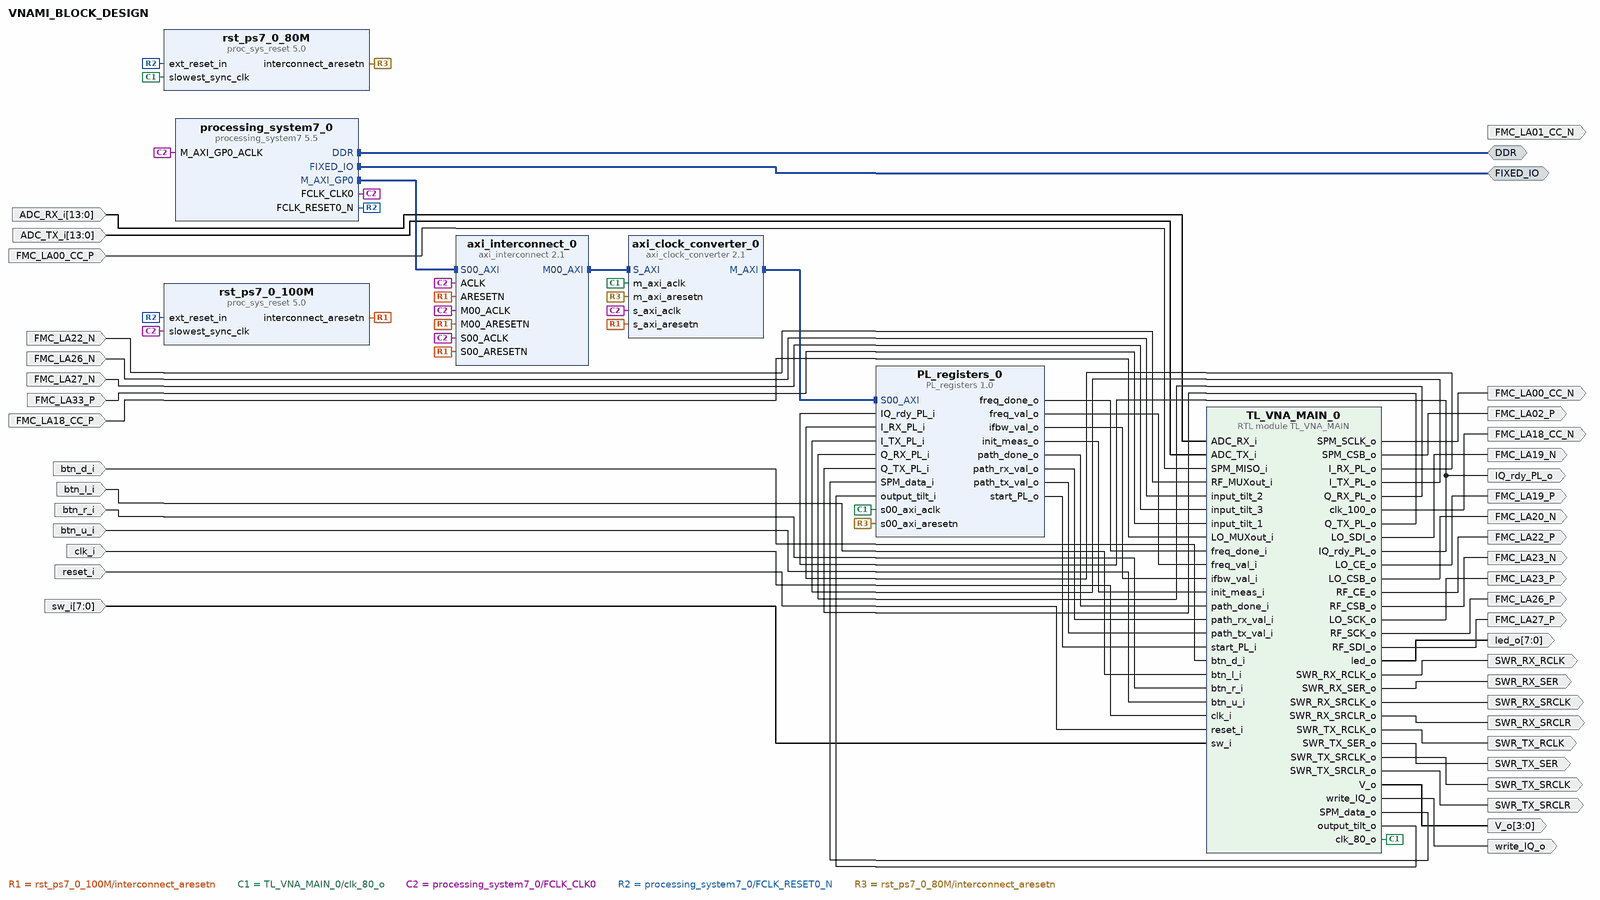
[diagram p0: block diagram of the top level]
# Vivado block design VNAMI_BLOCK_DESIGN, xc7z020clg484-1, Vivado 2023.2
create_bd_design VNAMI_BLOCK_DESIGN

create_bd_intf_port -mode Master -vlnv xilinx.com:interface:ddrx_rtl:1.0 DDR
create_bd_intf_port -mode Master -vlnv xilinx.com:display_processing_system7:fixedio_rtl:1.0 FIXED_IO
create_bd_port -dir O FMC_LA26_P
create_bd_port -dir I FMC_LA22_N
create_bd_port -dir O FMC_LA23_N
create_bd_port -dir O FMC_LA27_P
create_bd_port -dir I btn_d_i
create_bd_port -dir I btn_l_i
create_bd_port -dir I btn_r_i
create_bd_port -dir I btn_u_i
create_bd_port -dir I clk_i
create_bd_port -dir O -from 7 -to 0 led_o
create_bd_port -dir I -type rst reset_i
create_bd_port -dir I -from 7 -to 0 sw_i
create_bd_port -dir O FMC_LA23_P
create_bd_port -dir O FMC_LA20_N
create_bd_port -dir I FMC_LA18_CC_P
create_bd_port -dir O FMC_LA01_CC_N
create_bd_port -dir O FMC_LA18_CC_N
create_bd_port -dir I -from 13 -to 0 ADC_TX_i
create_bd_port -dir I -from 13 -to 0 ADC_RX_i
create_bd_port -dir I FMC_LA33_P
create_bd_port -dir I FMC_LA26_N
create_bd_port -dir I FMC_LA27_N
create_bd_port -dir O FMC_LA00_CC_N
create_bd_port -dir I FMC_LA00_CC_P
create_bd_port -dir O FMC_LA02_P
create_bd_port -dir O FMC_LA19_N
create_bd_port -dir O IQ_rdy_PL_o
create_bd_port -dir O write_IQ_o
create_bd_port -dir O SWR_TX_SER
create_bd_port -dir O SWR_TX_SRCLK
create_bd_port -dir O SWR_TX_RCLK
create_bd_port -dir O SWR_TX_SRCLR
create_bd_port -dir O SWR_RX_SER
create_bd_port -dir O SWR_RX_SRCLK
create_bd_port -dir O SWR_RX_SRCLR
create_bd_port -dir O SWR_RX_RCLK
create_bd_port -dir O FMC_LA22_P
create_bd_port -dir O FMC_LA19_P
create_bd_port -dir O -from 3 -to 0 V_o

create_bd_cell -type module -reference TL_VNA_MAIN TL_VNA_MAIN_0
create_bd_cell -type ip -vlnv Julien:user:PL_registers:1.0 PL_registers_0
create_bd_cell -type ip -vlnv xilinx.com:ip:proc_sys_reset:5.0 rst_ps7_0_100M
create_bd_cell -type ip -vlnv xilinx.com:ip:processing_system7:5.5 processing_system7_0
set_property -dict [list \
  CONFIG.PCW_APU_PERIPHERAL_FREQMHZ 666.666666 \
  CONFIG.PCW_ENET0_PERIPHERAL_ENABLE 0 \
  CONFIG.PCW_FPGA0_PERIPHERAL_FREQMHZ 100 \
  CONFIG.PCW_FPGA1_PERIPHERAL_FREQMHZ 80 \
  CONFIG.PCW_GPIO_MIO_GPIO_ENABLE 0 \
  CONFIG.PCW_PRESET_BANK1_VOLTAGE {LVCMOS 3.3V} \
  CONFIG.PCW_QSPI_PERIPHERAL_ENABLE 0 \
  CONFIG.PCW_SD0_PERIPHERAL_ENABLE 0 \
  CONFIG.PCW_UART1_PERIPHERAL_ENABLE 0 \
  CONFIG.PCW_UIPARAM_DDR_FREQ_MHZ 533.333333 \
  CONFIG.PCW_UIPARAM_DDR_PARTNO {MT41J128M8 JP-125} \
  CONFIG.PCW_USB0_PERIPHERAL_ENABLE 0 \
] [get_bd_cells processing_system7_0]
# 59 more settings of processing_system7_0 are not shown: defaults, MIO pin electricals, DDR timing, and values the tool derives
create_bd_cell -type ip -vlnv xilinx.com:ip:proc_sys_reset:5.0 rst_ps7_0_80M
create_bd_cell -type ip -vlnv xilinx.com:ip:axi_clock_converter:2.1 axi_clock_converter_0
create_bd_cell -type ip -vlnv xilinx.com:ip:axi_interconnect:2.1 axi_interconnect_0
set_property -dict {CONFIG.NUM_MI 1 CONFIG.S00_HAS_DATA_FIFO 0 CONFIG.S00_HAS_REGSLICE 3} [get_bd_cells axi_interconnect_0]

# ---- connections ----

connect_bd_intf_net [get_bd_intf_pins axi_interconnect_0/S00_AXI] [get_bd_intf_pins processing_system7_0/M_AXI_GP0]
connect_bd_intf_net [get_bd_intf_pins axi_clock_converter_0/M_AXI] [get_bd_intf_pins PL_registers_0/S00_AXI]
connect_bd_intf_net -intf_net axi_interconnect_1_M00_AXI [get_bd_intf_pins axi_interconnect_0/M00_AXI] [get_bd_intf_pins axi_clock_converter_0/S_AXI]
connect_bd_intf_net -intf_net processing_system7_1_DDR [get_bd_intf_ports DDR] [get_bd_intf_pins processing_system7_0/DDR]
connect_bd_intf_net -intf_net processing_system7_1_FIXED_IO [get_bd_intf_ports FIXED_IO] [get_bd_intf_pins processing_system7_0/FIXED_IO]
connect_bd_net -net ADC_RX_i_0_1 [get_bd_ports ADC_RX_i] [get_bd_pins TL_VNA_MAIN_0/ADC_RX_i]
connect_bd_net -net ADC_TX_i_0_1 [get_bd_ports ADC_TX_i] [get_bd_pins TL_VNA_MAIN_0/ADC_TX_i]
connect_bd_net [get_bd_ports FMC_LA00_CC_P] [get_bd_pins TL_VNA_MAIN_0/SPM_MISO_i]
connect_bd_net -net FMC_LA04_P_0_1 [get_bd_ports FMC_LA22_N] [get_bd_pins TL_VNA_MAIN_0/RF_MUXout_i]
connect_bd_net [get_bd_ports FMC_LA26_N] [get_bd_pins TL_VNA_MAIN_0/input_tilt_2]
connect_bd_net [get_bd_ports FMC_LA27_N] [get_bd_pins TL_VNA_MAIN_0/input_tilt_3]
connect_bd_net [get_bd_ports FMC_LA33_P] [get_bd_pins TL_VNA_MAIN_0/input_tilt_1]
connect_bd_net -net LO_MUXout_i_0_1 [get_bd_ports FMC_LA18_CC_P] [get_bd_pins TL_VNA_MAIN_0/LO_MUXout_i]
connect_bd_net [get_bd_pins PL_registers_0/freq_done_o] [get_bd_pins TL_VNA_MAIN_0/freq_done_i]
connect_bd_net [get_bd_pins PL_registers_0/freq_val_o] [get_bd_pins TL_VNA_MAIN_0/freq_val_i]
connect_bd_net [get_bd_pins PL_registers_0/ifbw_val_o] [get_bd_pins TL_VNA_MAIN_0/ifbw_val_i]
connect_bd_net [get_bd_pins PL_registers_0/init_meas_o] [get_bd_pins TL_VNA_MAIN_0/init_meas_i]
connect_bd_net [get_bd_pins PL_registers_0/path_done_o] [get_bd_pins TL_VNA_MAIN_0/path_done_i]
connect_bd_net [get_bd_pins PL_registers_0/path_rx_val_o] [get_bd_pins TL_VNA_MAIN_0/path_rx_val_i]
connect_bd_net [get_bd_pins PL_registers_0/path_tx_val_o] [get_bd_pins TL_VNA_MAIN_0/path_tx_val_i]
connect_bd_net [get_bd_pins PL_registers_0/start_PL_o] [get_bd_pins TL_VNA_MAIN_0/start_PL_i]
connect_bd_net -net S00_ARESETN_1 [get_bd_pins rst_ps7_0_100M/interconnect_aresetn] \
  [get_bd_pins axi_interconnect_0/S00_ARESETN] [get_bd_pins axi_interconnect_0/ARESETN] \
  [get_bd_pins axi_interconnect_0/M00_ARESETN] [get_bd_pins axi_clock_converter_0/s_axi_aresetn]
connect_bd_net -net TL_VNA_MAIN_0_CSB_o [get_bd_pins TL_VNA_MAIN_0/SPM_CSB_o] [get_bd_ports FMC_LA02_P]
connect_bd_net -net TL_VNA_MAIN_0_FMC_LA04_N [get_bd_pins TL_VNA_MAIN_0/RF_SCK_o] [get_bd_ports FMC_LA26_P]
connect_bd_net -net TL_VNA_MAIN_0_FMC_LA07_N [get_bd_pins TL_VNA_MAIN_0/RF_CSB_o] [get_bd_ports FMC_LA23_N]
connect_bd_net -net TL_VNA_MAIN_0_FMC_LA07_P [get_bd_pins TL_VNA_MAIN_0/RF_SDI_o] [get_bd_ports FMC_LA27_P]
connect_bd_net [get_bd_pins TL_VNA_MAIN_0/IQ_rdy_PL_o] [get_bd_ports IQ_rdy_PL_o] [get_bd_pins PL_registers_0/IQ_rdy_PL_i]
connect_bd_net [get_bd_pins TL_VNA_MAIN_0/I_RX_PL_o] [get_bd_pins PL_registers_0/I_RX_PL_i]
connect_bd_net [get_bd_pins TL_VNA_MAIN_0/I_TX_PL_o] [get_bd_pins PL_registers_0/I_TX_PL_i]
connect_bd_net [get_bd_pins TL_VNA_MAIN_0/LO_CE_o] [get_bd_ports FMC_LA19_P]
connect_bd_net [get_bd_pins TL_VNA_MAIN_0/LO_CSB_o] [get_bd_ports FMC_LA20_N]
connect_bd_net [get_bd_pins TL_VNA_MAIN_0/LO_SCK_o] [get_bd_ports FMC_LA23_P]
connect_bd_net [get_bd_pins TL_VNA_MAIN_0/LO_SDI_o] [get_bd_ports FMC_LA19_N]
connect_bd_net [get_bd_pins TL_VNA_MAIN_0/Q_RX_PL_o] [get_bd_pins PL_registers_0/Q_RX_PL_i]
connect_bd_net [get_bd_pins TL_VNA_MAIN_0/Q_TX_PL_o] [get_bd_pins PL_registers_0/Q_TX_PL_i]
connect_bd_net [get_bd_pins TL_VNA_MAIN_0/RF_CE_o] [get_bd_ports FMC_LA22_P]
connect_bd_net -net TL_VNA_MAIN_0_SCLK_o [get_bd_pins TL_VNA_MAIN_0/SPM_SCLK_o] [get_bd_ports FMC_LA00_CC_N]
connect_bd_net [get_bd_pins TL_VNA_MAIN_0/SPM_data_o] [get_bd_pins PL_registers_0/SPM_data_i]
connect_bd_net [get_bd_pins TL_VNA_MAIN_0/SWR_RX_RCLK_o] [get_bd_ports SWR_RX_RCLK]
connect_bd_net [get_bd_pins TL_VNA_MAIN_0/SWR_RX_SER_o] [get_bd_ports SWR_RX_SER]
connect_bd_net [get_bd_pins TL_VNA_MAIN_0/SWR_RX_SRCLK_o] [get_bd_ports SWR_RX_SRCLK]
connect_bd_net [get_bd_pins TL_VNA_MAIN_0/SWR_RX_SRCLR_o] [get_bd_ports SWR_RX_SRCLR]
connect_bd_net [get_bd_pins TL_VNA_MAIN_0/SWR_TX_RCLK_o] [get_bd_ports SWR_TX_RCLK]
connect_bd_net [get_bd_pins TL_VNA_MAIN_0/SWR_TX_SER_o] [get_bd_ports SWR_TX_SER]
connect_bd_net [get_bd_pins TL_VNA_MAIN_0/SWR_TX_SRCLK_o] [get_bd_ports SWR_TX_SRCLK]
connect_bd_net [get_bd_pins TL_VNA_MAIN_0/SWR_TX_SRCLR_o] [get_bd_ports SWR_TX_SRCLR]
connect_bd_net [get_bd_pins TL_VNA_MAIN_0/V_o] [get_bd_ports V_o]
connect_bd_net [get_bd_pins TL_VNA_MAIN_0/clk_100_o] [get_bd_ports FMC_LA18_CC_N]
connect_bd_net [get_bd_pins TL_VNA_MAIN_0/clk_80_o] \
  [get_bd_pins rst_ps7_0_80M/slowest_sync_clk] [get_bd_pins PL_registers_0/s00_axi_aclk] \
  [get_bd_pins axi_clock_converter_0/m_axi_aclk]
connect_bd_net [get_bd_pins TL_VNA_MAIN_0/led_o] [get_bd_ports led_o]
connect_bd_net [get_bd_pins TL_VNA_MAIN_0/output_tilt_o] [get_bd_pins PL_registers_0/output_tilt_i]
connect_bd_net [get_bd_pins TL_VNA_MAIN_0/write_IQ_o] [get_bd_ports write_IQ_o]
connect_bd_net -net btn_d_i_0_1 [get_bd_ports btn_d_i] [get_bd_pins TL_VNA_MAIN_0/btn_d_i]
connect_bd_net -net btn_l_i_0_1 [get_bd_ports btn_l_i] [get_bd_pins TL_VNA_MAIN_0/btn_l_i]
connect_bd_net -net btn_r_i_0_1 [get_bd_ports btn_r_i] [get_bd_pins TL_VNA_MAIN_0/btn_r_i]
connect_bd_net -net btn_u_i_0_1 [get_bd_ports btn_u_i] [get_bd_pins TL_VNA_MAIN_0/btn_u_i]
connect_bd_net [get_bd_ports clk_i] [get_bd_pins TL_VNA_MAIN_0/clk_i]
connect_bd_net [get_bd_pins processing_system7_0/FCLK_CLK0] \
  [get_bd_pins processing_system7_0/M_AXI_GP0_ACLK] [get_bd_pins rst_ps7_0_100M/slowest_sync_clk] \
  [get_bd_pins axi_interconnect_0/S00_ACLK] [get_bd_pins axi_interconnect_0/M00_ACLK] [get_bd_pins axi_interconnect_0/ACLK] \
  [get_bd_pins axi_clock_converter_0/s_axi_aclk]
connect_bd_net [get_bd_pins processing_system7_0/FCLK_RESET0_N] [get_bd_pins rst_ps7_0_100M/ext_reset_in] [get_bd_pins rst_ps7_0_80M/ext_reset_in]
connect_bd_net -net reset_i_0_1 [get_bd_ports reset_i] [get_bd_pins TL_VNA_MAIN_0/reset_i]
connect_bd_net -net rst_ps7_0_100M1_interconnect_aresetn [get_bd_pins rst_ps7_0_80M/interconnect_aresetn] \
  [get_bd_pins PL_registers_0/s00_axi_aresetn] [get_bd_pins axi_clock_converter_0/m_axi_aresetn]
connect_bd_net -net sw_i_0_1 [get_bd_ports sw_i] [get_bd_pins TL_VNA_MAIN_0/sw_i]

validate_bd_design
save_bd_design
